# Altium schematic sheet simulation.SchDoc
size A
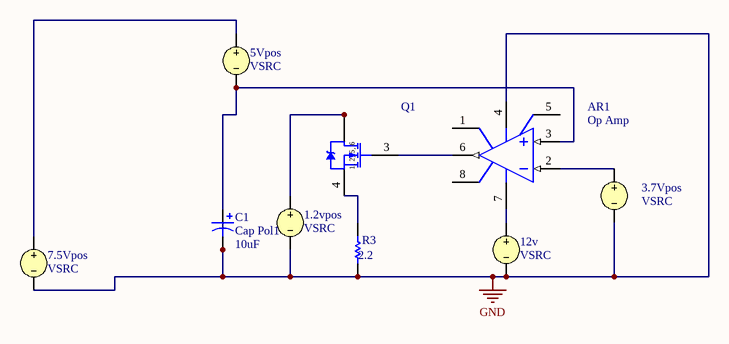
[diagram p0: simulation.SchDoc]

## Parts
1.2vpos  VSRC
3.7Vpos  VSRC
5Vpos  VSRC
7.5Vpos  VSRC
12v  VSRC
AR1  Op Amp  [H-08A]
C1  Cap Pol1  value 10uF  [RB7.6-15]
Q1  (no value)  [TSOP-6]
R3  value 2.2  [AXIAL-0.4]  (hidden comment: resistor)

## Nets
GND: 1.2vpos.2 3.7Vpos.2 7.5Vpos.2 12v.2 AR1.4(V-) C1.2 R3.1
Net1.2vpos_1: 1.2vpos.1 Q1.1(D) Q1.2(D) Q1.5(D) Q1.6(D)
Net3.7Vpos_1: 3.7Vpos.1 AR1.2(IN-)
Net5Vpos_1: 5Vpos.1 7.5Vpos.1
Net5Vpos_2: 5Vpos.2 AR1.3(IN+) C1.1
Net12v_1: 12v.1 AR1.7(V+)
NetAR1_6: AR1.6(OUT) Q1.3(G)
NetQ1_4: Q1.4(S) R3.2

Not connected (* = marked no-connect by the designer): AR1 1(OS_NUL) 5(OS_NUL) 8(TAB)

## Notes on the sheet
- (in symbol IRF5801) 1, 2, 5, 6

## Library data of the parts
1.2vpos = VSRC: Voltage Source; Note: PCB Footprint - Not required; Value: 3V; Published: 8-Jun-2000; LatestRevisionDate: 17-Jul-2002; LatestRevisionNote: Re-released for DXP Platform.; PackageReference: Not Applicable; Publisher: Altium Limited
3.7Vpos = VSRC: Voltage Source; Note: PCB Footprint - Not required; Value: +3.7V; Published: 8-Jun-2000; LatestRevisionDate: 17-Jul-2002; LatestRevisionNote: Re-released for DXP Platform.; PackageReference: Not Applicable; Publisher: Altium Limited
5Vpos = VSRC: Voltage Source; Note: PCB Footprint - Not required; Value: +5; Published: 8-Jun-2000; LatestRevisionDate: 17-Jul-2002; LatestRevisionNote: Re-released for DXP Platform.; PackageReference: Not Applicable; Publisher: Altium Limited
7.5Vpos = VSRC: Voltage Source; Note: PCB Footprint - Not required; Value: +7.5; Published: 8-Jun-2000; LatestRevisionDate: 17-Jul-2002; LatestRevisionNote: Re-released for DXP Platform.; PackageReference: Not Applicable; Publisher: Altium Limited
12v = VSRC: Voltage Source; Note: PCB Footprint - Not required; Value: +10; Published: 8-Jun-2000; LatestRevisionDate: 17-Jul-2002; LatestRevisionNote: Re-released for DXP Platform.; PackageReference: Not Applicable; Publisher: Altium Limited
AR1 = Op Amp: FET Operational Amplifier; Published: 8-Jun-2000; LatestRevisionDate: 17-Jul-2002; LatestRevisionNote: Re-released for DXP Platform.; DatasheetVersion: REV. B; PackageVersion: 1990; PackageReference: H-08A; Publisher: Altium Limited; PackageDescription: Can; 8 Leads; Pin Circle Dia. 5.08 mm; Lead Dia. 0.53 mm (max); ComponentLink1Description: Manufacturer Link; ComponentLink1URL: http://www.analog.com/
C1 = Cap Pol1: Polarized Capacitor (Radial); Published: 8-Jun-2000; LatestRevisionDate: 17-Jul-2002; LatestRevisionNote: Re-released for DXP Platform.; PackageReference: RB7.6-15; Publisher: Altium Limited; PackageDescription: Polarized Capacitor (Radial); 2 Leads
Q1 = IRF5801: HEXFET Power MOSFET; Published: 17-Sep-2003; DatasheetVersion: 9-Jul-2002; PackageVersion: Jul-2002; PackageReference: TSOP-6; Publisher: Altium Limited; PackageDescription: SOT-457/SC-74; 6 Leads; Body 3.1 x 2.9 mm, inc. leads (LxW max); Code_JEDEC: MO-193AA; ComponentLink1Description: Manufacturer Link; ComponentLink1URL: http://www.irf.com/; ComponentLink2Description: Datasheet; ComponentLink2URL: http://www.irf.com/product-info/datasheets/data/IRHN7130.pdf
R3 = RES: Published: 8-Jun-2000; LatestRevisionDate: 17-Jul-2002; LatestRevisionNote: Re-released for DXP Platform.; PackageReference: AXIAL-0.3; Publisher: Altium Limited; PackageDescription: Axial Device, Thru-Hole; 2 Leads; 0.3 in Pin Spacing